# Altium project logi-cam.PrjPcb
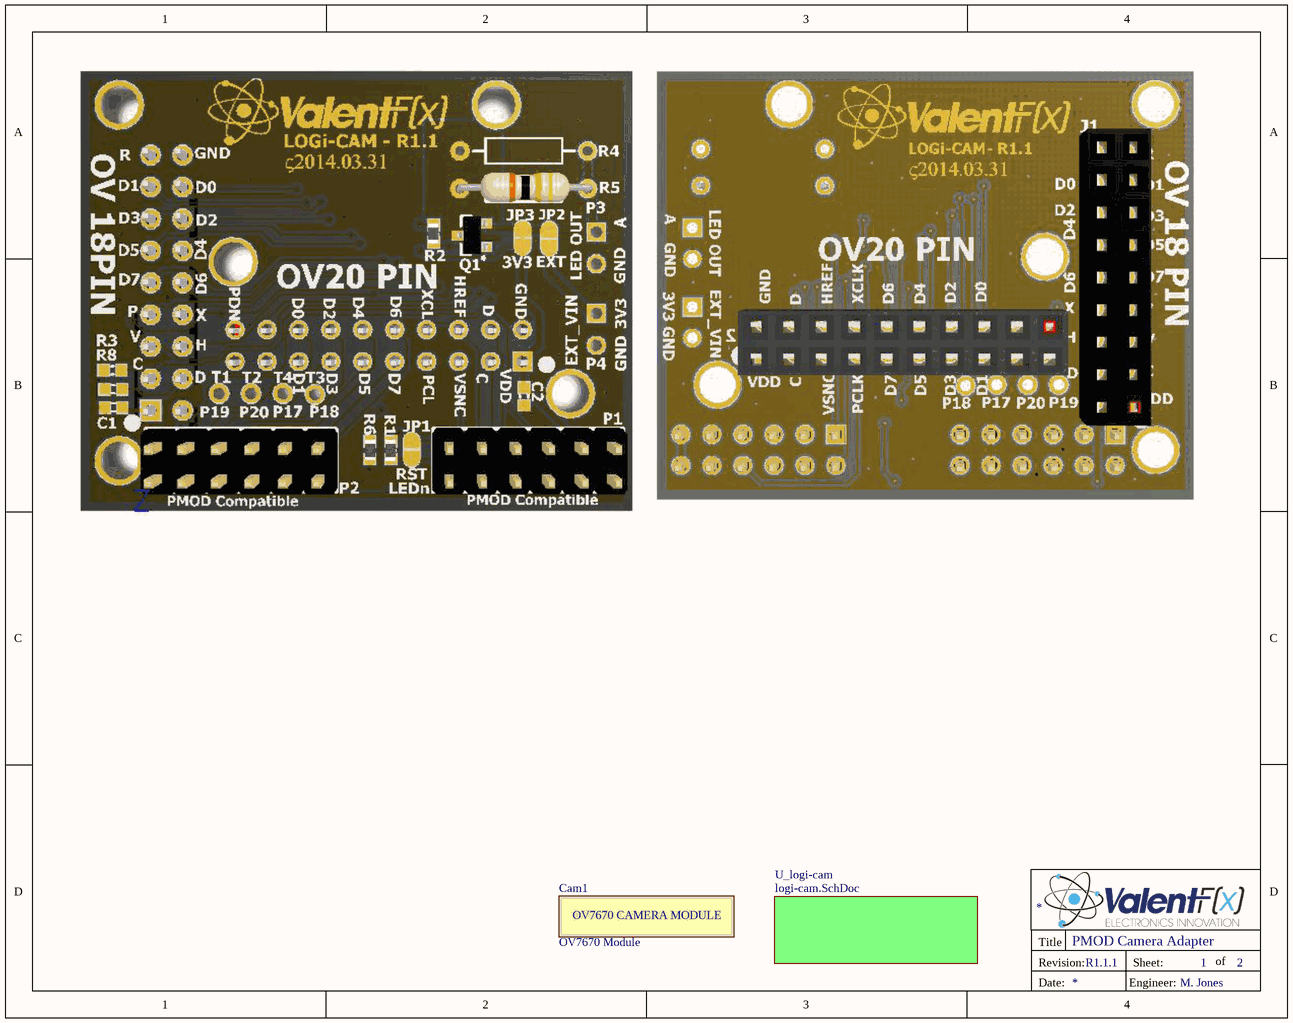
[diagram p0: logi-cam-top.SchDoc]
PrjEngineer: M. Jones; PrjRevision: R1.1.1
2 sheets, 26 parts. Net scope: global (net labels, ports and power ports of the same name join across sheets).
Board file: logi-cam.PcbDoc
Sheets:
  logi-cam-top.SchDoc
    U_logi-cam = logi-cam.SchDoc

## Sheet logi-cam-top.SchDoc: PMOD Camera Adapter
size A; Engineer: Michael Jones; DocumentNumber: 1; Revision: RA.1; SheetNumber: 1; SheetTotal: 2; ProjectName: OV7725

### Parts
Cam1  OV7670 Module  (mechanical)

### Sub-sheets
U_logi-cam = logi-cam.SchDoc: no entries

### Notes on the sheet
- Title
- Revision:
- Sheet:
- of
- Date:
- Engineer:
- (in symbol OV7670 - Module) OV7670 CAMERA MODULE

### Library data of the parts
Cam1 = OV7670 - Module: OV7670 Camera Module; Supplier 1: http://guangshunsz.en.alibaba.com/product/1477353955-220119761/OV7670_Arduino_Camera_Module_for_collect_photograph_for_arduino_module_for_Arduino_Module_Board.html; Supplier Link 2: http://guangshunsz.en.alibaba.com/; Value: OV7670 Module; Price: 1x 5.40, 100x 5.14

## Sheet logi-cam.SchDoc: PMOD Camera Adapter
size A; Engineer: Michael Jones; DocumentNumber: 2; Revision: RA.1; SheetNumber: 2; SheetTotal: 2; ProjectName: OV7725
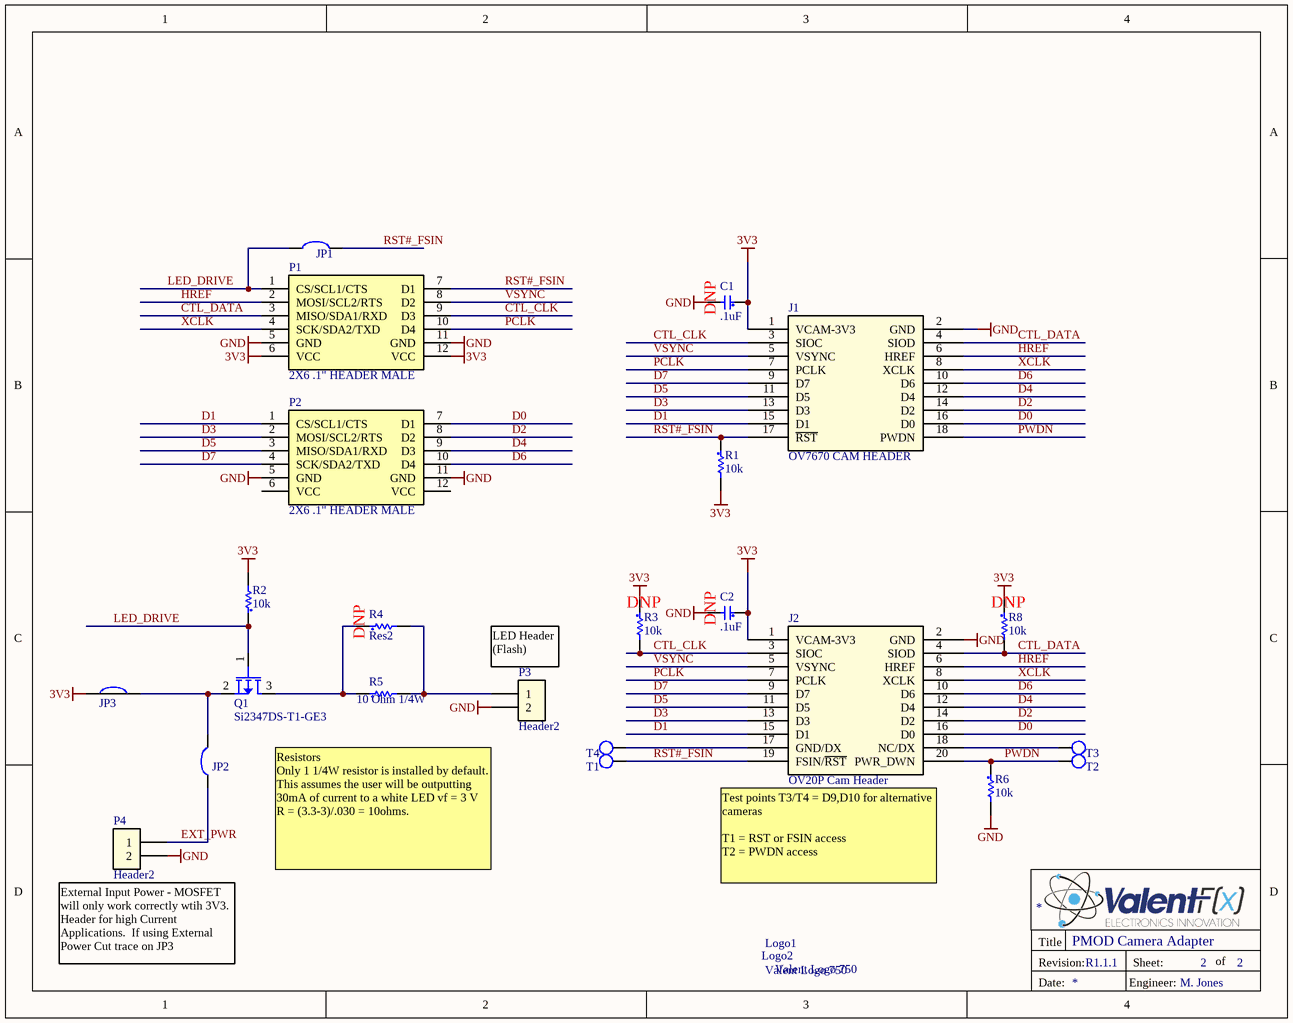
[diagram p1: logi-cam.SchDoc]

### Parts
C1  .1uF  [C0603]
C2  .1uF  [C0603]
J1  OV7670 CAM HEADER  [HEADER_9x2_40_100 1-3-5 THRU DIP]
J2  OV20P Cam Header  [HEADER_10x2_40_100 1-3-5 THRU DIP]
JP1  Solder Jumper  [SOLDER_JUMPER]  (value not drawn)  (no BOM)
JP2  Solder Jumper  [SOLDER_JUMPER]  (value not drawn)  (no BOM)
JP3  Solder Jumper-NC  [SOLDER_JUMPER-NC]  (value not drawn)  (net tie, no BOM)
Logo1  Valent Logo 750  [VALENTFX_750-SolderMask-BOT]  (no BOM)
Logo2  Valent Logo 750  [VALENTFX_750-SolderMask-BOT]  (no BOM)
P1  2X6 .1" HEADER MALE  [PMOD HEADER - Male Vertical]
P2  2X6 .1" HEADER MALE  [PMOD HEADER - Male Vertical]
P3  Header2  [HEADER_2_40_100 THRU SIP]  (no BOM)
P4  Header2  [HEADER_2_40_100 THRU SIP]  (no BOM)
Q1  Si2347DS-T1-GE3  [sot-23]
R1  10k  [R0603]
R2  10k  [R0603]
R3  10k  [R0603]
R4  Res2  [AXIAL-0.4]
R5  10 Ohm 1/4W  [AXIAL-0.4]
R6  10k  [R0603]
R8  10k  [R0603]
T1  Test Point  [Tp 35-50]  (value not drawn)  (no BOM)
T2  Test Point  [Tp 35-50]  (value not drawn)  (no BOM)
T3  Test Point  [Tp 35-50]  (value not drawn)  (no BOM)
T4  Test Point  [Tp 35-50]  (value not drawn)  (no BOM)

### Nets
3V3: C1.1 C2.1 J1.1(VCAM-3V3) J2.1(VCAM-3V3) JP3.1 P1.6(VCC) P1.12(VCC) R1.2 R2.2 R3.1 R8.1
GND: C1.2 C2.2 J1.2(GND) J2.2(GND) P1.5(GND) P1.11(GND) P2.5(GND) P2.11(GND) P3.2 P4.2 R6.2
CTL_CLK: J1.3(SIOC) J2.3(SIOC) P1.9(D3) R3.2
CTL_DATA: J1.4(SIOD) J2.4(SIOD) P1.3(MISO/SDA1/RXD) R8.2
D0: J1.16(D0) J2.16(D0) P2.7(D1)
D1: J1.15(D1) J2.15(D1) P2.1(CS/SCL1/CTS)
D2: J1.14(D2) J2.14(D2) P2.8(D2)
D3: J1.13(D3) J2.13(D3) P2.2(MOSI/SCL2/RTS)
D4: J1.12(D4) J2.12(D4) P2.9(D3)
D5: J1.11(D5) J2.11(D5) P2.3(MISO/SDA1/RXD)
D6: J1.10(D6) J2.10(D6) P2.10(D4)
D7: J1.9(D7) J2.9(D7) P2.4(SCK/SDA2/TXD)
EXT_PWR: JP2.1 P4.1
HREF: J1.6(HREF) J2.6(HREF) P1.2(MOSI/SCL2/RTS)
LED_DRIVE: JP1.1 P1.1(CS/SCL1/CTS) Q1.1(G) R2.1
PCLK: J1.7(PCLK) J2.7(PCLK) P1.10(D4)
PWDN: J1.18(PWDN) J2.20(PWR_DWN) R6.1 T2.1
RST#_FSIN: J1.17(~{RST}) J2.19(FSIN/~{RST}) JP1.2 P1.7(D1) R1.1 T1.1
VSYNC: J1.5(VSYNC) J2.5(VSYNC) P1.8(D2)
XCLK: J1.8(XCLK) J2.8(XCLK) P1.4(SCK/SDA2/TXD)
NetJ2_17: J2.17(GND/DX) T4.1
NetJ2_18: J2.18(NC/DX) T3.1
NetJP2_2: JP2.2 JP3.2 Q1.2(S)
NetP3_1: P3.1 R4.2 R5.2
NetQ1_3: Q1.3(D) R4.1 R5.1

Not connected (* = marked no-connect by the designer): P2 6(VCC) 12(VCC)

### Notes on the sheet
- (near C1) DNP
- (near R4) DNP
- (near R3) DNP
- (near C2) DNP
- (near R8) DNP
- (near P3) LED Header
  (Flash)
- Resistors
  Only 1 1/4W resistor is installed by default.  This assumes the user will be outputting 30mA of current to a white LED vf = 3 V
  R = (3.3-3)/.030 = 10ohms.
- (near J2) Test points T3/T4 = D9,D10 for alternative cameras
  T1 = RST or FSIN access
  T2 = PWDN access
- (near P4) External Input Power - MOSFET will only work correctly wtih 3V3.  Header for high Current Applications.  If using External Power Cut trace on JP3
- Title
- Revision:
- Sheet:
- of
- Date:
- Engineer:

### Library data of the parts
C1 C2 = C0603 - C1608X7R1E104MT: .10uF X7R 20% (MLCC) - SMD/SMT 0603 25volts; Manufacturer: TDK; Capacitance: 0.1 uF; Supplier 1: Mouser; Manufacturer Part Number: C1608X7R1E104MT; RoHS: RoHS Compliant By Exemption; Category: Multilayer Ceramic Capacitors (MLCC) - SMD/SMT; Stock 1: 69148; Pricing 1: 1=0.365, 50=0.149, 100=0.085, 500=0.045, 1000=0.030, 4000=0.027, 8000=0.023, 12000=0.019, 20000=0.018 (AUD); Dimensions: 0.8 mm W x 1.6 mm L; Operating Temperature Range: - 55 C to + 125 C; Package / Case: 0603 (1608 metric); Packaging: Reel; Product: General Type MLCCs; Termination Style: SMD/SMT; Tolerance: 20 %; Voltage Rating: 25 Volts; Product Category: Low & Medium Capacitance SMD Ceramic Chip Capacitors; Standard Pack Qty: 4000.0; Temperature Coefficient / Code: X7R; RoHS - Mouser: E; Minimum Order Quantity: 1; Reeling: True; ComponentLink1URL: http://www.tdk.co.jp/tefe02/e411_c.pdf; ComponentLink1Description: http://www.tdk.co.jp/tefe02/e411_c.pdf; Supplier Part Number 1: 810-C1608X7R1E104M; Value: .1uF
J1 = CAM - OV7670: CONN HEADER FMAL 18PS .1" DL GOLD; Manufacturer: Sullins Connector Solutions; Manufacturer Part Number: PPPC092LFBN-RC; Number of Positions: 18; Number of Positions Loaded: All; Pitch: 0.100" (2.54mm); Value: PPPC092LFBN-RC; Supplier 1: Digi-Key; RoHS: RoHS Compliant; Category: Connectors, Interconnects; Stock 1: 3381; Pricing 1: 1=1.38, 10=1.145, 25=1.06, 50=0.954, 100=0.848, 250=0.742, 500=0.6784, 1000=0.6148, 2500=0.5512 (USD); Packaging: Bulk; Connector Type: Header; Contact Type: Female Socket; Number of Rows: 2; Row Spacing: 0.100" (2.54mm); Mounting Type: Through Hole; Termination: Solder; Fastening Type: -; Features: -; Contact Finish: Gold; Contact Finish Thickness: Flash; Color: Black; ComponentLink1URL: http://www.sullinscorp.com/drawings/78_P(N)PxCxxxLFBN-RC,_10492-G.pdf; ComponentLink1Description: http://www.sullinscorp.com/drawings/78_P(N)PxCxxxLFBN-RC,_10492-G.pdf; Supplier Part Number 1: S7112-ND
J2 = CAM - 0V20P: CONN HEADR FMALE 20 POS .1" DL AU; Manufacturer: Sullins Connector Solutions; Manufacturer Part Number: PPPC102LFBN-RC; Number of Positions: 20; Number of Positions Loaded: All; Pitch: 0.100" (2.54mm); Supplier 1: Digi-Key; RoHS: RoHS Compliant; Category: Connectors, Interconnects; Stock 1: 4350; Pricing 1: 1=1.51, 10=1.246, 25=1.1676, 50=1.038, 100=0.9342, 250=0.86156, 500=0.7785, 1000=0.69027, 2500=0.66172 (USD); Packaging: Bulk; Connector Type: Header; Contact Type: Female Socket; Number of Rows: 2; Row Spacing: 0.100" (2.54mm); Mounting Type: Through Hole; Termination: Solder; Fastening Type: -; Features: -; Contact Finish: Gold; Contact Finish Thickness: Flash; Color: Black; ComponentLink1URL: http://www.sullinscorp.com/drawings/78_P(N)PxCxxxLFBN-RC,_10492-G.pdf; ComponentLink1Description: http://www.sullinscorp.com/drawings/78_P(N)PxCxxxLFBN-RC,_10492-G.pdf; Supplier Part Number 1: S6106-ND
JP1 JP2 = Solder Jumper: Solder/Configuration Jumper; Manufacturer: n/a; Manufacturer Part Number: n/a; Source: n/a; Source Part Number: n/a; ROHS Certificate: n/a
JP3 = Solder Jumper-NC: Solder/Configuration Jumper; Manufacturer: n/a; Manufacturer Part Number: n/a; Source: n/a; Source Part Number: n/a; ROHS Certificate: n/a
P1 P2 = P-MOD - PRPC006DAAN-RC: CONN HEADER .100" DUAL STR 12 POS; Manufacturer: Sullins Connector Solutions; Connector Type: Header, Unshrouded; Number of Positions: 12; Number of Positions Loaded: All; Pitch: 0.100" (2.54mm); Supplier 1: Digi-Key; Manufacturer Part Number: PRPC006DAAN-RC; RoHS: RoHS Compliant; Category: Connectors, Interconnects; Stock 1: 0; Pricing 1: 1=0.46, 10=0.41, 100=0.3378, 500=0.26702, 1000=0.22923, 5000=0.20912, 10000=0.20108 (USD); Packaging: Bulk; Contact Type: Male Pin; Number of Rows: 2; Row Spacing: 0.100" (2.54mm); Contact Mating Length: 0.230" (5.84mm); Mounting Type: Through Hole; Termination: Solder; Fastening Type: -; Features: -; Contact Finish: Gold; Contact Finish Thickness: Flash; Color: Black; ComponentLink1URL: http://media.digikey.com/PDF/Data%20Sheets/Sullins%20PDFs/xRxCzzzDxxN-RC_11636-B.pdf; ComponentLink1Description: http://media.digikey.com/PDF/Data%20Sheets/Sullins%20PDFs/xRxCzzzDxxN-RC_11636-B.pdf; Supplier Part Number 1: S2011EC-06-ND; Value: 2X6 .1" HEADER MALE
P3 P4 = Header2: Header 2 pin
Q1 = PMOS - Si2347DS-T1-GE3: MOSFET -30V .042Ohm@10V 5A P-Ch G-III; Manufacturer: Vishay Semiconductors; Accept Compatible Replacement Part: Yes; Configuration: Single; Continuous Drain Current: - 3.9 A; Forward Transconductance - Min: 10 S; Gate-Source Breakdown Voltage: 20 V; Power Dissipation: 1.7 W; Rds On: 68 mOhms; Transistor Polarity: P-Channel; Fall Time: 9 ns; Gate Charge Qg: 6.9 nC; Rise Time: 6 ns; Typical Turn-Off Delay Time: 19 ns; Product Status: New Product; Supplier 1: Mouser; Manufacturer Part Number: Si2347DS-T1-GE3; RoHS: RoHS Compliant; Category: MOSFET; Stock 1: 8482; Pricing 1: 1=0.203, 10=0.189, 100=0.135, 250=0.122, 500=0.108, 3000=0.095 (AUD); Package / Case: SOT-23-3; Packaging: Reel; Drain-Source Breakdown Voltage: - 30 V; Mounting Style: SMD/SMT; Maximum Operating Temperature: + 150 C; Minimum Operating Temperature: - 55 C; Product Category: P-Channel MOSFETs; Standard Pack Qty: 3000; RoHS - Mouser: Y; Minimum Order Quantity: 1; Reeling: True; ComponentLink1URL: http://www.mouser.com/ds/2/427/si2347ds-279626.pdf; ComponentLink1Description: http://www.mouser.com/ds/2/427/si2347ds-279626.pdf; Supplier Part Number 1: 78-SI2347DS-T1-GE3
R1-R3 R6 R8 = R0603 - CRCW060310K0FKEA: 10k Thick Film Resistors - SMD 1/10watt 10Kohms 1%; Manufacturer: Vishay Dale; Power (Watts): 0.1W, 1/10W; Temperature Coefficient: ±100ppm/°C; Supplier 1: Digi-Key; Manufacturer Part Number: CRCW060310K0FKEA; RoHS: RoHS Compliant; Category: Resistors; Stock 1: 997856; Pricing 1: 10=0.081, 50=0.0436, 200=0.0251, 1000=0.01711 (USD); Resistance (Ohms): 10K; Composition: Thick Film; Features: -; Tolerance: ±1%; Package / Case: 0603 (1608 Metric); Size / Dimension: 0.061" L x 0.033" W (1.55mm x 0.85mm); Height: 0.020" (0.50mm); Number of Terminations: 2; Packaging: Cut Tape (CT); ComponentLink1URL: http://www.vishay.com/doc?20035; ComponentLink1Description: http://www.vishay.com/doc?20035; Supplier Part Number 1: 541-10.0KHCT-ND; Value: 10k
R4 = Res2: 1/4W .4 Axial; PackageReference: AXIAL-0.4; PackageDescription: Axial Device, Thru-Hole; 2 Leads; 0.4 in Pin Spacing
R5 = AX_25 - MF1/4DCT52R10R0F2: Metal Film Resistors - Through Hole 10ohms 1% 100PPM; Manufacturer: KOA Speer; Power Rating: 250 mW (1/4 W); Temperature Coefficient: 100 PPM / C; Voltage Rating: 250 V; Case Diameter: 2.3 mm; Case Length: 7.1 mm; Lead Diameter: 0.6 mm; Value: 10; Supplier 1: Mouser; Manufacturer Part Number: MF1/4DCT52R10R0F2; RoHS: RoHS Compliant; Category: Metal Film Resistors - Through Hole; Stock 1: 12930; Pricing 1: 1=0.081, 5000=0.027, 10000=0.020, 50000=0.011, 100000=0.009 (AUD); Operating Temperature Range: - 55 C to + 155 C; Packaging: Reel; Product: Metal Film Resistors General Purpose; Resistance: 10 Ohms; Series: MF; Termination Style: Axial; Tolerance: 1 %; Type: General Purpose Metal Film Leaded Resistor; Lead Spacing: 30 mm; Product Category: 1/4Watt Metal Film Resistors; Standard Pack Qty: 5000; RoHS - Mouser: Y; Minimum Order Quantity: 1; Reeling: True; ComponentLink1URL: http://www.koaspeer.com/catimages/Products/MF-MFS-RK/MF-MFS-RK.pdf; ComponentLink1Description: http://www.koaspeer.com/catimages/Products/MF-MFS-RK/MF-MFS-RK.pdf; Supplier Part Number 1: 660-MF1/4DCT52R10R0F
T1-T4 = Test Point 2: Test Point Smaller Symbol

## Assembly variants
MFG: not fitted C1 C2 R3 R4 R8
Complete: all parts fitted